# Altium project Carte_alim_moteur.PrjPcb
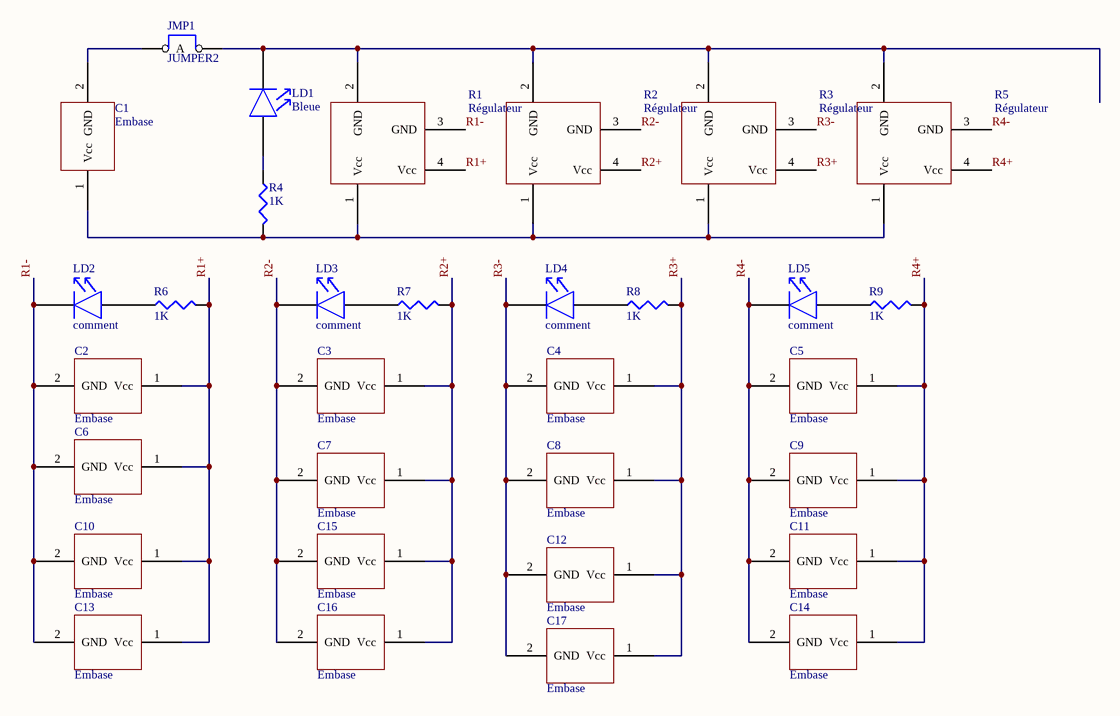
[diagram p0: Sheet1.SchDoc]
1 sheet, 32 parts. Net scope: global (net labels, ports and power ports of the same name join across sheets).
Board file: LPKF_ISEN_MAXSIZE_18-05-2016.PCBDOC

## Sheet Sheet1.SchDoc
size A4

### Parts
C1  Embase  [POWER__2]
C2  Embase  [POWER__2]
C3  Embase  [POWER__2]
C4  Embase  [POWER__2]
C5  Embase  [POWER__2]
C6  Embase  [POWER__2]
C7  Embase  [POWER__2]
C8  Embase  [POWER__2]
C9  Embase  [POWER__2]
C10  Embase  [POWER__2]
C11  Embase  [POWER__2]
C12  Embase  [POWER__2]
C13  Embase  [POWER__2]
C14  Embase  [POWER__2]
C15  Embase  [POWER__2]
C16  Embase  [POWER__2]
C17  Embase  [POWER__2]
JMP1  JUMPER2  [JMP2-100]
LD1  Bleue  [LED1206]
LD2  comment  [LED1206]
LD3  comment  [LED1206]
LD4  comment  [LED1206]
LD5  comment  [LED1206]
R1  Régulateur  [Régulateur]
R2  Régulateur  [Régulateur]
R3  Régulateur  [Régulateur]
R4  value 1K  [0805]
R5  Régulateur  [Régulateur]
R6  value 1K  [0805]  (hidden comment: RES)
R7  value 1K  [0805]  (hidden comment: RES)
R8  value 1K  [0805]  (hidden comment: RES)
R9  value 1K  [0805]  (hidden comment: RES)

### Nets
R1+: C2.1(Vcc) C6.1(Vcc) C10.1(Vcc) C13.1(Vcc) R1.4(Vcc) R6.2
R1-: C2.2(GND) C6.2(GND) C10.2(GND) C13.2(GND) LD2.K R1.3(GND)
R2+: C3.1(Vcc) C7.1(Vcc) C15.1(Vcc) C16.1(Vcc) R2.4(Vcc) R7.2
R2-: C3.2(GND) C7.2(GND) C15.2(GND) C16.2(GND) LD3.K R2.3(GND)
R3+: C4.1(Vcc) C8.1(Vcc) C12.1(Vcc) C17.1(Vcc) R3.4(Vcc) R8.2
R3-: C4.2(GND) C8.2(GND) C12.2(GND) C17.2(GND) LD4.K R3.3(GND)
R4+: C5.1(Vcc) C9.1(Vcc) C11.1(Vcc) C14.1(Vcc) R5.4(Vcc) R9.2
R4-: C5.2(GND) C9.2(GND) C11.2(GND) C14.2(GND) LD5.K R5.3(GND)
NetC1_1: C1.1(Vcc) R1.1(Vcc) R2.1(Vcc) R3.1(Vcc) R4.2 R5.1(Vcc)
NetC1_2: C1.2(GND) JMP1.1(A)
NetJMP1_2: JMP1.2(com) LD1.K R1.2(GND) R2.2(GND) R3.2(GND) R5.2(GND)
NetLD1_A: LD1.A R4.1
NetLD2_A: LD2.A R6.1
NetLD3_A: LD3.A R7.1
NetLD4_A: LD4.A R8.1
NetLD5_A: LD5.A R9.1

### Library data of the parts
C1-C17 = Embase: Embase 2 broches
JMP1 = JUMPER2: cavalier 1 position
LD1-LD5 = LED: LED 5mm/3mm/CMS
R1-R3 R5 = Régulateur: Régulateur de tension
R4 R6-R9 = RES: resistance